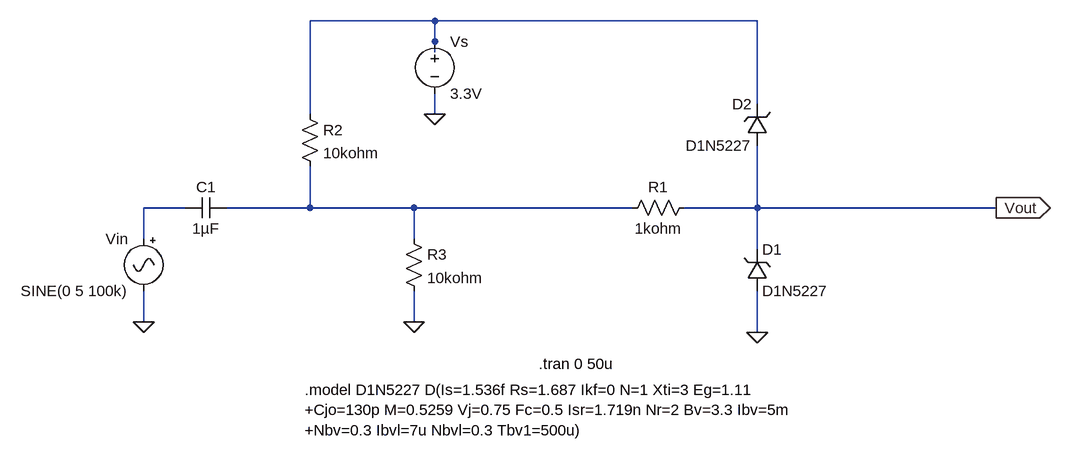
[diagram p0: schematic clipper_clamper_protection_schematic.asc]
clipper_clamper_protection_schematic.asc, the LTspice schematic file:
Version 4
SHEET 1 1152 680
WIRE -80 -208 -272 -208
WIRE 416 -208 -80 -208
WIRE -80 -176 -80 -208
WIRE -80 -160 -80 -176
WIRE 416 -80 416 -208
WIRE -272 -64 -272 -208
WIRE -80 -64 -80 -96
WIRE -464 80 -528 80
WIRE -272 80 -272 16
WIRE -272 80 -400 80
WIRE -112 80 -272 80
WIRE 224 80 -112 80
WIRE 416 80 416 -16
WIRE 416 80 304 80
WIRE 784 80 416 80
WIRE -528 128 -528 80
WIRE -112 128 -112 80
WIRE 416 144 416 80
WIRE -528 256 -528 208
WIRE -112 256 -112 208
WIRE 416 272 416 208
FLAG 784 80 Vout
IOPIN 784 80 Out
FLAG 416 272 0
FLAG -528 256 0
FLAG -80 -64 0
FLAG -112 256 0
SYMBOL res 320 64 R90
WINDOW 0 0 56 VBottom 2
WINDOW 3 32 56 VTop 2
SYMATTR InstName R1
SYMATTR Value 1kohm
SYMBOL zener 400 208 M180
WINDOW 0 24 64 Left 2
WINDOW 3 24 0 Left 2
SYMATTR InstName D1
SYMATTR Value D1N5227
SYMBOL Misc\\signal -528 112 M0
WINDOW 123 0 0 Left 0
WINDOW 39 0 0 Left 0
SYMATTR InstName Vin
SYMATTR Value SINE(0 5 100k)
SYMBOL voltage -80 -192 R0
WINDOW 123 0 0 Left 0
WINDOW 39 0 0 Left 0
SYMATTR InstName Vs
SYMATTR Value 3.3V
SYMBOL zener 432 -16 R180
WINDOW 0 24 64 Left 2
WINDOW 3 24 0 Left 2
SYMATTR InstName D2
SYMATTR Value D1N5227
SYMBOL cap -400 64 R90
WINDOW 0 0 32 VBottom 2
WINDOW 3 32 32 VTop 2
SYMATTR InstName C1
SYMATTR Value 1µF
SYMBOL res -288 -80 R0
SYMATTR InstName R2
SYMATTR Value 10kohm
SYMBOL res -128 112 R0
SYMATTR InstName R3
SYMATTR Value 10kohm
TEXT 80 320 Left 2 !.tran 0 50u
TEXT -280 360 Left 2 !.model D1N5227 D(Is=1.536f Rs=1.687 Ikf=0 N=1 Xti=3 Eg=1.11\n+Cjo=130p M=0.5259 Vj=0.75 Fc=0.5 Isr=1.719n Nr=2 Bv=3.3 Ibv=5m\n+Nbv=0.3 Ibvl=7u Nbvl=0.3 Tbv1=500u)

The netlist it stands for:
* clipper_clamper_protection_schematic.asc
R1 Vout N003 1kohm
D1 0 Vout D1N5227
Vin N002 0 SINE(0 5 100k)
Vs N001 0 3.3V
D2 Vout N001 D1N5227
C1 N003 N002 1µF
R2 N001 N003 10kohm
R3 N003 0 10kohm
.model D D
.lib standard.dio
.tran 0 50u
.model D1N5227 D(Is=1.536f Rs=1.687 Ikf=0 N=1 Xti=3 Eg=1.11
+Cjo=130p M=0.5259 Vj=0.75 Fc=0.5 Isr=1.719n Nr=2 Bv=3.3 Ibv=5m
+Nbv=0.3 Ibvl=7u Nbvl=0.3 Tbv1=500u)
.backanno
.end